# Altium schematic sheet INT_REG.SchDoc
size A4; SheetNumber: 13; SheetTotal: 13
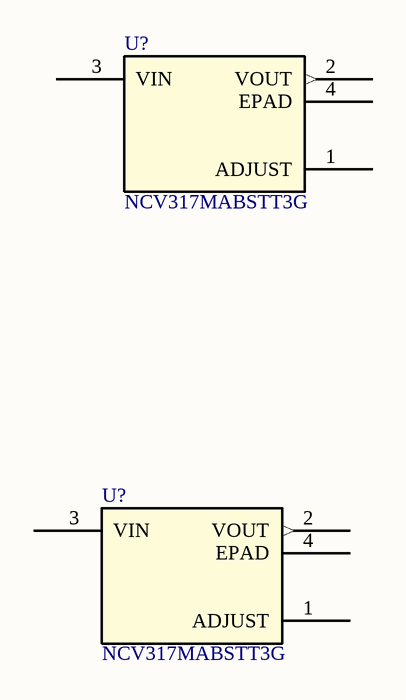
[diagram p0: INT_REG.SchDoc]

## Parts
(Parts that share a designator on the sheet are numbered #1, #2 ... from top to bottom, then left to right.)
U?#1  NCV317MABSTT3G  [NCV317MABSTT3G-Footprint-1]
U?#2  NCV317MABSTT3G  [NCV317MABSTT3G-Footprint-1]

## Nets

Not connected (* = marked no-connect by the designer): U?#1 1(ADJUST) 2(VOUT) 3(VIN) 4(EPAD); U?#2 1(ADJUST) 2(VOUT) 3(VIN) 4(EPAD)

## Library data of the parts
U?#1 U?#2 = CMP-019-00064-1: Linear Voltage Regulator, 0.5 A, Ultra-High PSRR Vout: 4%; TJ = -40°C to 125°C; Output Voltage: 37V; Max Supply Voltage: 40V; Min Supply Voltage: 2.8V; Min Operating Temperature: -40°C; Max Operating Temperature: 125°C; Case/Package: SOT-223-4; Mounting Technology: Surface Mount